# Altium schematic sheet Sheet1.SchDoc
size A4
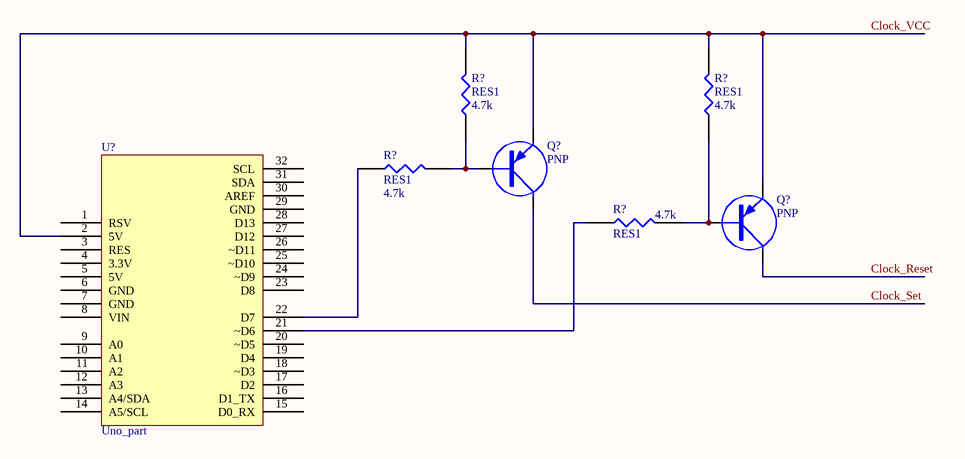
[diagram p0: Sheet1.SchDoc]

## Parts
(Parts that share a designator on the sheet are numbered #1, #2 ... from top to bottom, then left to right.)
Q?#1  PNP
Q?#2  PNP
R?#1  RES1  value 4.7k
R?#2  RES1  value 4.7k
R?#3  RES1  value 4.7k
R?#4  RES1  value 4.7k
U?  Uno_part  [UNO]

## Nets
Clock_Reset: Q?#2.3(C)
Clock_Set: Q?#1.3(C)
Clock_VCC: Q?#1.1(E) Q?#2.1(E) R?#1.2 R?#2.2 U?.2(5V)
NetQ?#1_2: Q?#1.2(B) R?#1.1 R?#3.2
NetQ?#2_2: Q?#2.2(B) R?#2.1 R?#4.2
NetR?#3_1: R?#3.1 U?.22(D7)
NetR?#4_1: R?#4.1 U?.21(~D6)

Not connected (* = marked no-connect by the designer): U? 1(RSV) 3(RES) 4(3.3V) 5(5V) 6(GND) 7(GND) 8(VIN) 9(A0) 10(A1) 11(A2) 12(A3) 13(A4/SDA) 14(A5/SCL) 15(D0_RX) 16(D1_TX) 17(D2) 18(~D3) 19(D4) 20(~D5) 23(D8) 24(~D9) 25(~D10) 26(~D11) 27(D12) 28(D13) 29(GND) 30(AREF) 31(SDA) 32(SCL)

## Library data of the parts
Q?#1 Q?#2 = PNP: PNP Transistor